# Altium schematic sheet cs301_YourGroupNumber.SchDoc
size A2
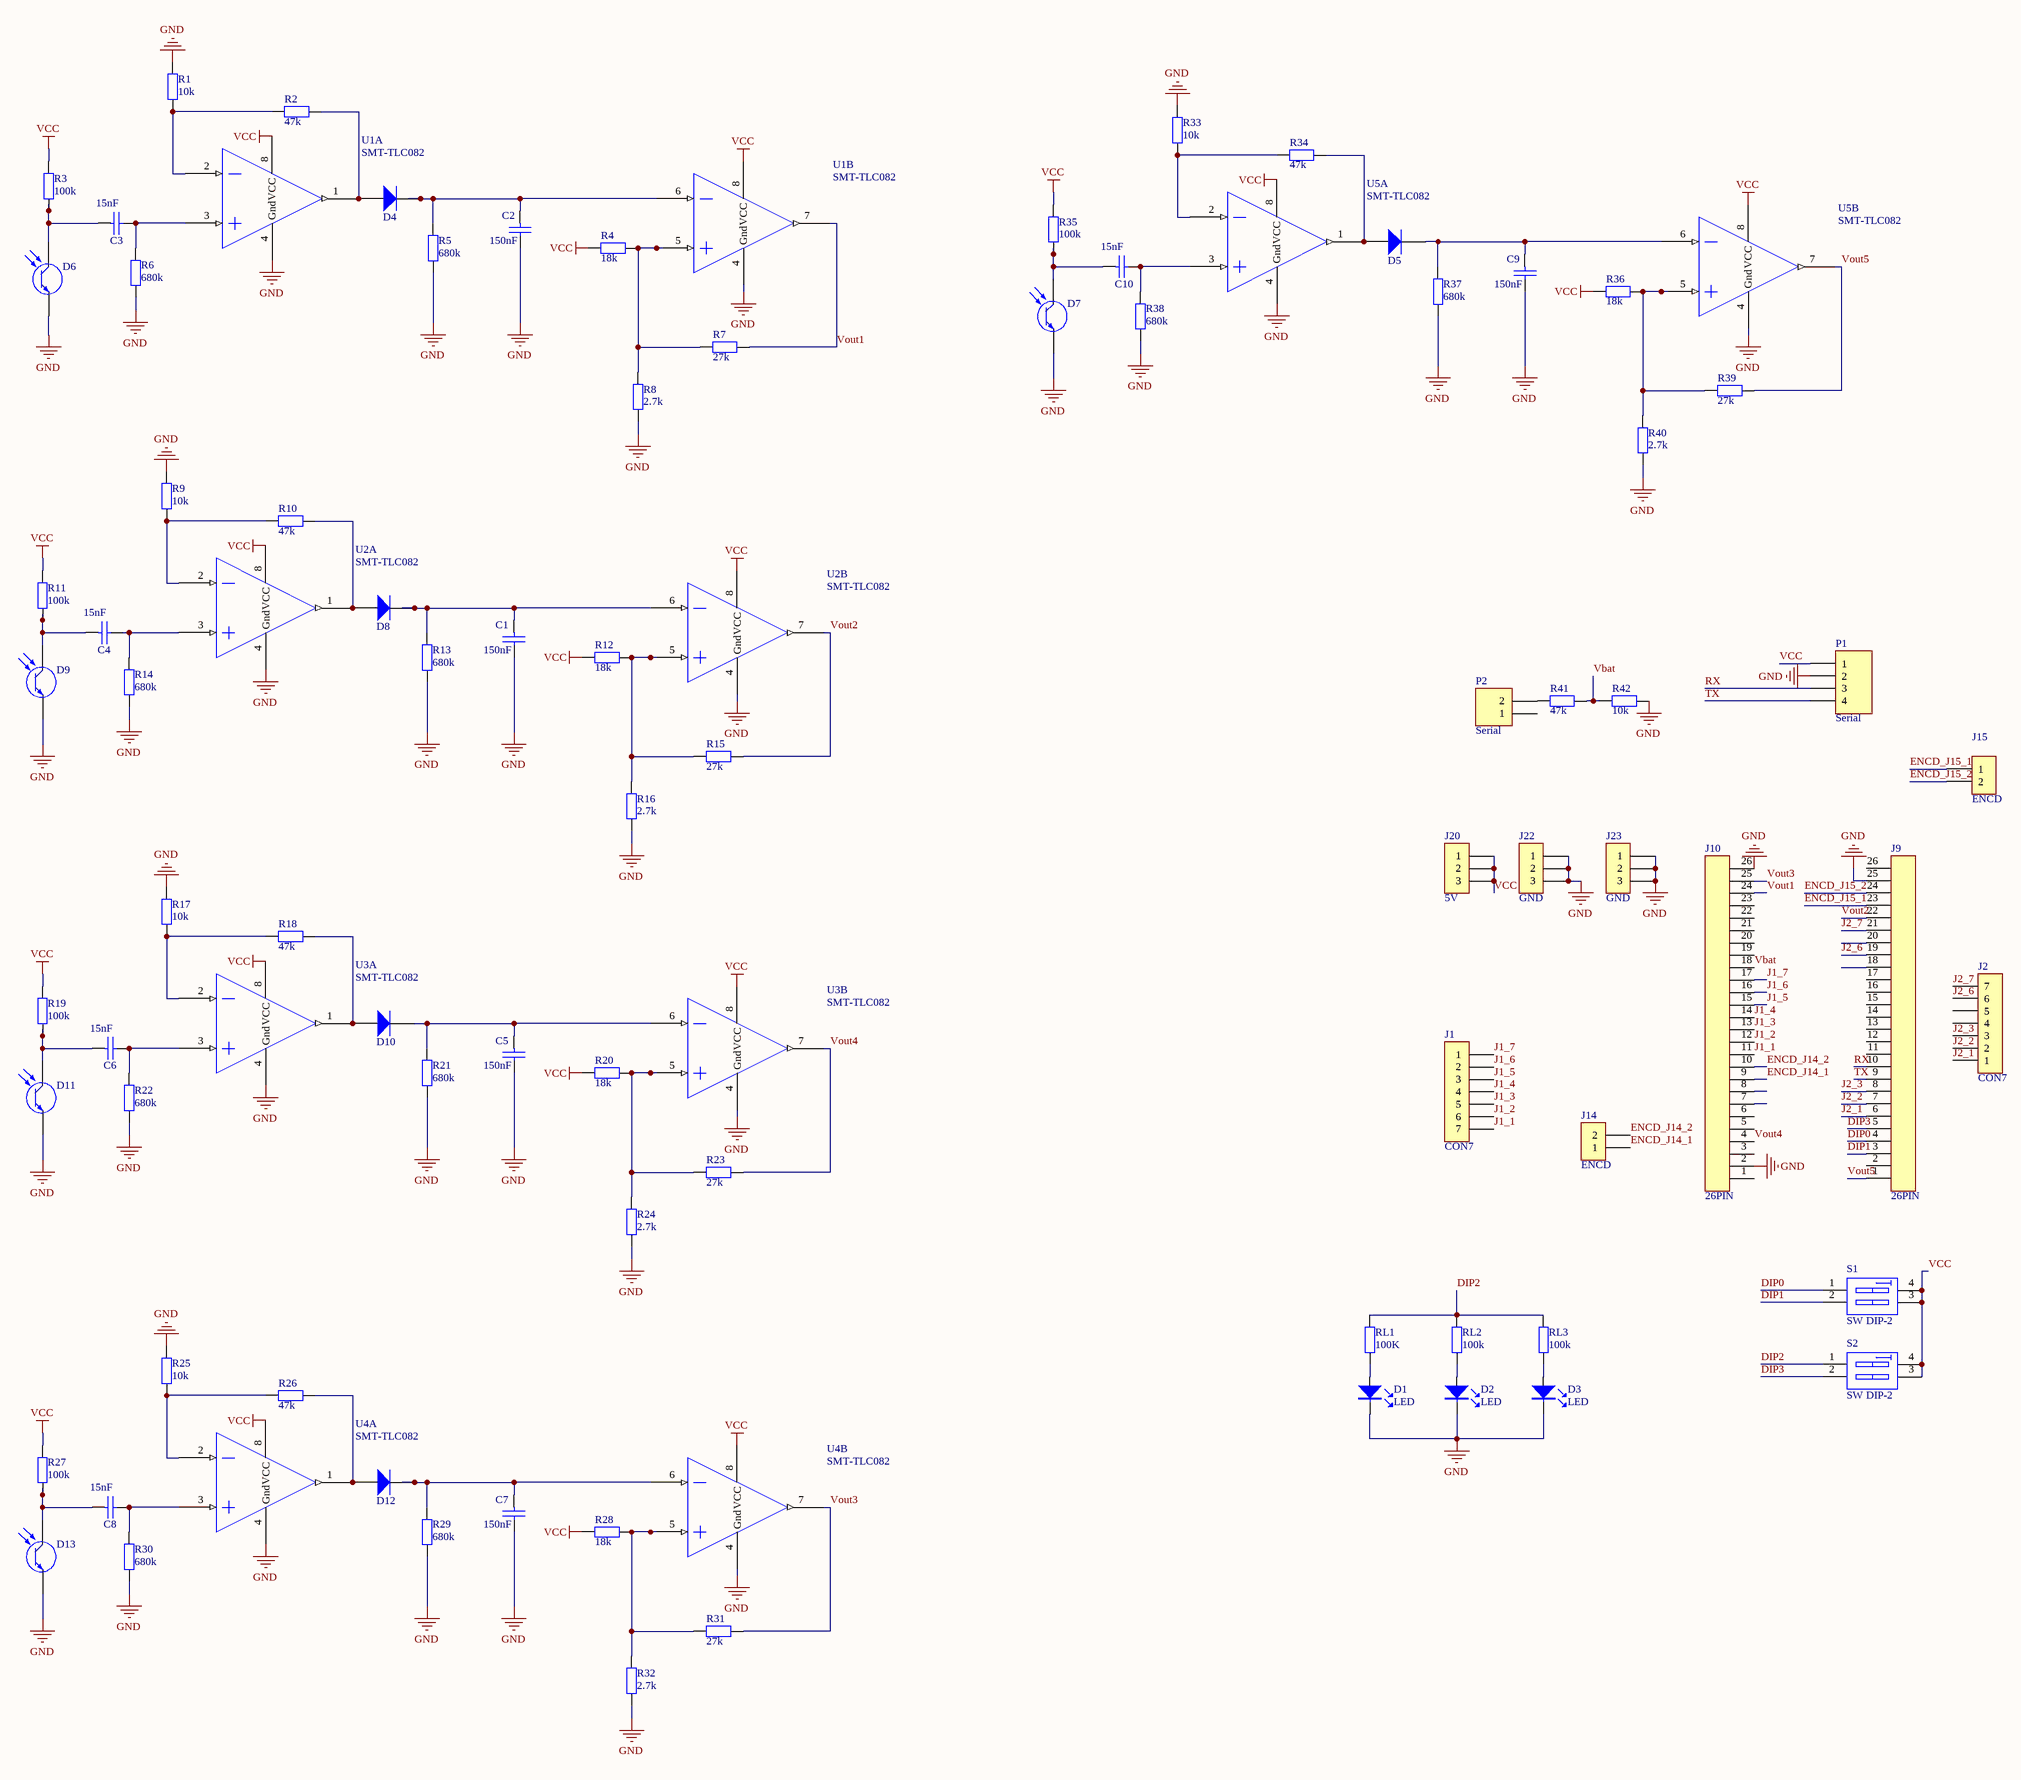
[diagram p0: cs301_YourGroupNumber.SchDoc]

## Parts
C1  150nF  [ECE-CAPC1608-0603SM]
C2  150nF  [ECE-CAPC1608-0603SM]
C3  15nF  [ECE-CAPC1608-0603SM]
C4  15nF  [ECE-CAPC1608-0603SM]
C5  150nF  [ECE-CAPC1608-0603SM]
C6  15nF  [ECE-CAPC1608-0603SM]
C7  150nF  [ECE-CAPC1608-0603SM]
C8  15nF  [ECE-CAPC1608-0603SM]
C9  150nF  [ECE-CAPC1608-0603SM]
C10  15nF  [ECE-CAPC1608-0603SM]
D1  LED  [LED0.1/5MM]
D2  LED  [LED0.1/5MM]
D3  LED  [LED0.1/5MM]
D4  1N4148W-7-F  [ECE-DIO-SOD123SM]  (value not drawn)
D5  1N4148W-7-F  [ECE-DIO-SOD123SM]  (value not drawn)
D6  TEMT6200  [ECE-SENSOR-0805SM]  (value not drawn)
D7  TEMT6200  [ECE-SENSOR-0805SM]  (value not drawn)
D8  1N4148W-7-F  [ECE-DIO-SOD123SM]  (value not drawn)
D9  TEMT6200  [ECE-SENSOR-0805SM]  (value not drawn)
D10  1N4148W-7-F  [ECE-DIO-SOD123SM]  (value not drawn)
D11  TEMT6200  [ECE-SENSOR-0805SM]  (value not drawn)
D12  1N4148W-7-F  [ECE-DIO-SOD123SM]  (value not drawn)
D13  TEMT6200  [ECE-SENSOR-0805SM]  (value not drawn)
J1  CON7  [SIP7]
J2  CON7  [SIP7]
J9  26PIN  [SIP26]
J10  26PIN  [SIP26]
J14  ENCD  [sip2]
J15  ENCD  [sip2]
J20  5V  [sip3]
J22  GND  [sip3]
J23  GND  [sip3]
P1  Serial  [ece-HDR1X4]
P2  Serial  [HDR1X2]
R1  10k  [RESC2012-0805SM]
R2  47k  [RESC2012-0805SM]
R3  100k  [RESC2012-0805SM]
R4  18k  [RESC2012-0805SM]
R5  680k  [RESC2012-0805SM]
R6  680k  [RESC2012-0805SM]
R7  27k  [RESC2012-0805SM]
R8  2.7k  [RESC2012-0805SM]
R9  10k  [RESC2012-0805SM]
R10  47k  [RESC2012-0805SM]
R11  100k  [RESC2012-0805SM]
R12  18k  [RESC2012-0805SM]
R13  680k  [RESC2012-0805SM]
R14  680k  [RESC2012-0805SM]
R15  27k  [RESC2012-0805SM]
R16  2.7k  [RESC2012-0805SM]
R17  10k  [RESC2012-0805SM]
R18  47k  [RESC2012-0805SM]
R19  100k  [RESC2012-0805SM]
R20  18k  [RESC2012-0805SM]
R21  680k  [RESC2012-0805SM]
R22  680k  [RESC2012-0805SM]
R23  27k  [RESC2012-0805SM]
R24  2.7k  [RESC2012-0805SM]
R25  10k  [RESC2012-0805SM]
R26  47k  [RESC2012-0805SM]
R27  100k  [RESC2012-0805SM]
R28  18k  [RESC2012-0805SM]
R29  680k  [RESC2012-0805SM]
R30  680k  [RESC2012-0805SM]
R31  27k  [RESC2012-0805SM]
R32  2.7k  [RESC2012-0805SM]
R33  10k  [RESC2012-0805SM]
R34  47k  [RESC2012-0805SM]
R35  100k  [RESC2012-0805SM]
R36  18k  [RESC2012-0805SM]
R37  680k  [RESC2012-0805SM]
R38  680k  [RESC2012-0805SM]
R39  27k  [RESC2012-0805SM]
R40  2.7k  [RESC2012-0805SM]
R41  47k  [RESC2012-0805SM]
R42  10k  [RESC2012-0805SM]
RL1  100K  [RESC2012-0805SM]
RL2  100k  [RESC2012-0805SM]
RL3  100k  [RESC2012-0805SM]
S1  SW DIP-2  [DIP-4]
S2  SW DIP-2  [DIP-4]
U1  SMT-TLC082  [SO-8]  (parts A,B of 2)
U2  SMT-TLC082  [SO-8]  (parts A,B of 2)
U3  SMT-TLC082  [SO-8]  (parts A,B of 2)
U4  SMT-TLC082  [SO-8]  (parts A,B of 2)
U5  SMT-TLC082  [SO-8]  (parts A,B of 2)

## Nets
GND: C1.2 C2.2 C5.2 C7.2 C9.2 D1.K D2.K D3.K D6.1(E) D7.1(E) D9.1(E) D11.1(E) D13.1(E) J9.25 J10.2 J10.26 J22.1 J22.2 J22.3 J23.1 J23.2 J23.3 P1.2 R1.2 R5.1 R6.1 R8.1 R9.2 R13.1 R14.1 R16.1 R17.2 R21.1 R22.1 R24.1 R25.2 R29.1 R30.1 R32.1 R33.2 R37.1 R38.1 R40.1 R42.1 U1.4(Gnd) U2.4(Gnd) U3.4(Gnd) U4.4(Gnd) U5.4(Gnd)
VCC: J20.1 J20.2 J20.3 P1.1 R3.2 R4.2 R11.2 R12.2 R19.2 R20.2 R27.2 R28.2 R35.2 R36.2 S1.3(B2) S1.4(B1) S2.3(B2) S2.4(B1) U1.8(VCC) U2.8(VCC) U3.8(VCC) U4.8(VCC) U5.8(VCC)
DIP0: J9.4 S1.1(A1)
DIP1: J9.3 S1.2(A2)
DIP2: RL1.2 RL2.2 RL3.2 S2.1(A1)
DIP3: J9.5 S2.2(A2)
ENCD_J14_1: J10.9 J14.1
ENCD_J14_2: J10.10 J14.2
ENCD_J15_1: J9.23 J15.1
ENCD_J15_2: J9.24 J15.2
J1_1: J1.7 J10.11
J1_2: J1.6 J10.12
J1_3: J1.5 J10.13
J1_4: J1.4 J10.14
J1_5: J1.3 J10.15
J1_6: J1.2 J10.16
J1_7: J1.1 J10.17
J2_1: J2.1 J9.6
J2_2: J2.2 J9.7
J2_3: J2.3 J9.8
J2_6: J2.6 J9.19
J2_7: J2.7 J9.21
RX: J9.10 P1.3
TX: J9.9 P1.4
Vbat: J10.18 R41.1 R42.2
Vout1: J10.24 R7.1 U1.7(OUT2)
Vout2: J9.22 R15.1 U2.7(OUT2)
Vout3: J10.25 R31.1 U4.7(OUT2)
Vout4: J10.4 R23.1 U3.7(OUT2)
Vout5: J9.1 R39.1 U5.7(OUT2)
NetC1_1: C1.1 D8.2(K) R13.2 U2.6(IN2(-))
NetC2_1: C2.1 D4.2(K) R5.2 U1.6(IN2(-))
NetC3_1: C3.1 D6.2(C) R3.1
NetC3_2: C3.2 R6.2 U1.3(IN1(+))
NetC4_1: C4.1 D9.2(C) R11.1
NetC4_2: C4.2 R14.2 U2.3(IN1(+))
NetC5_1: C5.1 D10.2(K) R21.2 U3.6(IN2(-))
NetC6_1: C6.1 D11.2(C) R19.1
NetC6_2: C6.2 R22.2 U3.3(IN1(+))
NetC7_1: C7.1 D12.2(K) R29.2 U4.6(IN2(-))
NetC8_1: C8.1 D13.2(C) R27.1
NetC8_2: C8.2 R30.2 U4.3(IN1(+))
NetC9_1: C9.1 D5.2(K) R37.2 U5.6(IN2(-))
NetC10_1: C10.1 D7.2(C) R35.1
NetC10_2: C10.2 R38.2 U5.3(IN1(+))
NetD1_A: D1.A RL1.1
NetD2_A: D2.A RL2.1
NetD3_A: D3.A RL3.1
NetD4_1: D4.1(A) R2.1 U1.1(OUT1)
NetD5_1: D5.1(A) R34.1 U5.1(OUT1)
NetD8_1: D8.1(A) R10.1 U2.1(OUT1)
NetD10_1: D10.1(A) R18.1 U3.1(OUT1)
NetD12_1: D12.1(A) R26.1 U4.1(OUT1)
NetP2_2: P2.2 R41.2
NetR1_1: R1.1 R2.2 U1.2(IN1(-))
NetR4_1: R4.1 R7.2 R8.2 U1.5(IN2(+))
NetR9_1: R9.1 R10.2 U2.2(IN1(-))
NetR12_1: R12.1 R15.2 R16.2 U2.5(IN2(+))
NetR17_1: R17.1 R18.2 U3.2(IN1(-))
NetR20_1: R20.1 R23.2 R24.2 U3.5(IN2(+))
NetR25_1: R25.1 R26.2 U4.2(IN1(-))
NetR28_1: R28.1 R31.2 R32.2 U4.5(IN2(+))
NetR33_1: R33.1 R34.2 U5.2(IN1(-))
NetR36_1: R36.1 R39.2 R40.2 U5.5(IN2(+))

Not connected (* = marked no-connect by the designer): J2 4 5; J9 2 11 12 13 14 15 16 17 18 20 26; J10 1 3 5 6 7 8 19 20 21 22 23; P2 1

## Library data of the parts
C1 C2 C5 C7 C9 = CAP000625: CAP CER 150nF 25V X7R SM0603; Manufactuer: TDK; Manufacturer-PN: C1608X7R1E154K080AA; Assembly Method: Surface Mount; Item Type: Item; Path: ece/ts/Lists/Stock Inventory; Value: 150nF; UoA Stock#: CAP000625; Size/Package: 0603 (1608 Metric); Voltage/Current: 25V; Supplier1: Digikey; Supplier1-PN: 445-5190-2-ND; Component Type: CAP-0603-150nF; Category: Capacitor; Status: Active
C3 C4 C6 C8 C10 = CAP000619: CAP CER 15nF 50V X7R SM0603; Manufactuer: Samsung; Manufacturer-PN: CL10B153KB8NNNC; Assembly Method: Surface Mount; Item Type: Item; Path: ece/ts/Lists/Stock Inventory; Value: 15nF; UoA Stock#: CAP000619; Size/Package: 0603 (1608 Metric); Voltage/Current: 50V; Supplier1: Digikey; Supplier1-PN: 1276-1277-2-ND; Component Type: CAP-0603-15nF; Category: Capacitor; Status: Active
D4 D5 D8 D10 D12 = DIO000103: DIODE GEN PURPOSE 300mA SM; Manufactuer: Diodes Incorporated; Assembly Method: Surface Mount; Voltage/Current: 300mA 100V; Item Type: Item; Path: ece/ts/Lists/Stock Inventory; Value: 1N4148W-7-F; UoA Stock#: DIO000103; Size/Package: SOD123; Manufacturer-PN: 1N4148W-7-F; Datasheet Link: http://share.engineering.auckland.ac.nz/ece/ts/Student%20Documents/Diode-4148SM.pdf; Supplier1: Digikey; Supplier1-PN: 1N4148W-FDITR-ND; Component Type: SOD123-4148; Category: Diode; Status: Active
D6 D7 D9 D11 D13 = OTH000001: LIGHT SENSOR TEMT6200 SM; Manufactuer: Vishay; Manufacturer-PN: TEMT6200FX01; Assembly Method: Surface Mount; Item Type: Item; Path: ece/ts/Lists/Stock Inventory; Revision: July-2002: Re-released for DXP Platform.; UoA Stock#: OTH000001; Value: TEMT6200; Size/Package: 0805/2012; Datasheet Link: http://share.engineering.auckland.ac.nz/ece/ts/Student%20Documents/temt6200.pdf; Supplier1: Digikey; Supplier1-PN: 751-1056-1-ND; Component Type: SEN-0805-TEMT6200; Category: Other; Status: Non Stocked
J1 J2 = CON7: Connector
J14 J15 = CON2: Connector
J20 J22 J23 = CON3: Connector
P1 = Header 4: Header, 4-Pin; LatestRevisionDate: 17-Jul-2002; LatestRevisionNote: Re-released for DXP Platform.; Publisher: Altium Limited
P2 = Header 2: Header, 2-Pin; LatestRevisionDate: 17-Jul-2002; LatestRevisionNote: Re-released for DXP Platform.; Publisher: Altium Limited
R1 R3 R4 R7-R9 R11 R12 R15-R17 R19 R20 R23-R25 R27 R28 R31-R33 R35 R36 R39 R40 RL1-RL3 = Res SM 0805: SM resistor
  R1 R9 R17 R25 R33: Value: 10k
  R3 R11 R19 R27 R35: Value: 100k
  R4 R12 R20 R28 R36: Value: 18k
  R7 R15 R23 R31 R39: Value: 27k
  R8 R16 R24 R32 R40: Value: 2.7k
  RL1-RL3: Value: *
R2 R10 R18 R26 R34 = Res SM 0805: SM resistor; Value: 56k
R5 R13 R21 R29 R37 = Res SM 0805: SM resistor; Value: 820k
R6 R14 R22 R30 R38 = Res SM 0805: SM resistor; Value: 100k
R41 R42 = Res SM 0805: SM resistor; Value: 27k
S1 S2 = SW DIP-2: DIP Switch, 2 Position, SPST; Published: 24-Mar-1999; LatestRevisionDate: 17-Jul-2002; LatestRevisionNote: Re-released for DXP Platform.; PackageReference: DIP-4; Publisher: Altium Limited